# EAGLE design Xbee Remote (EAGLE 6.3)
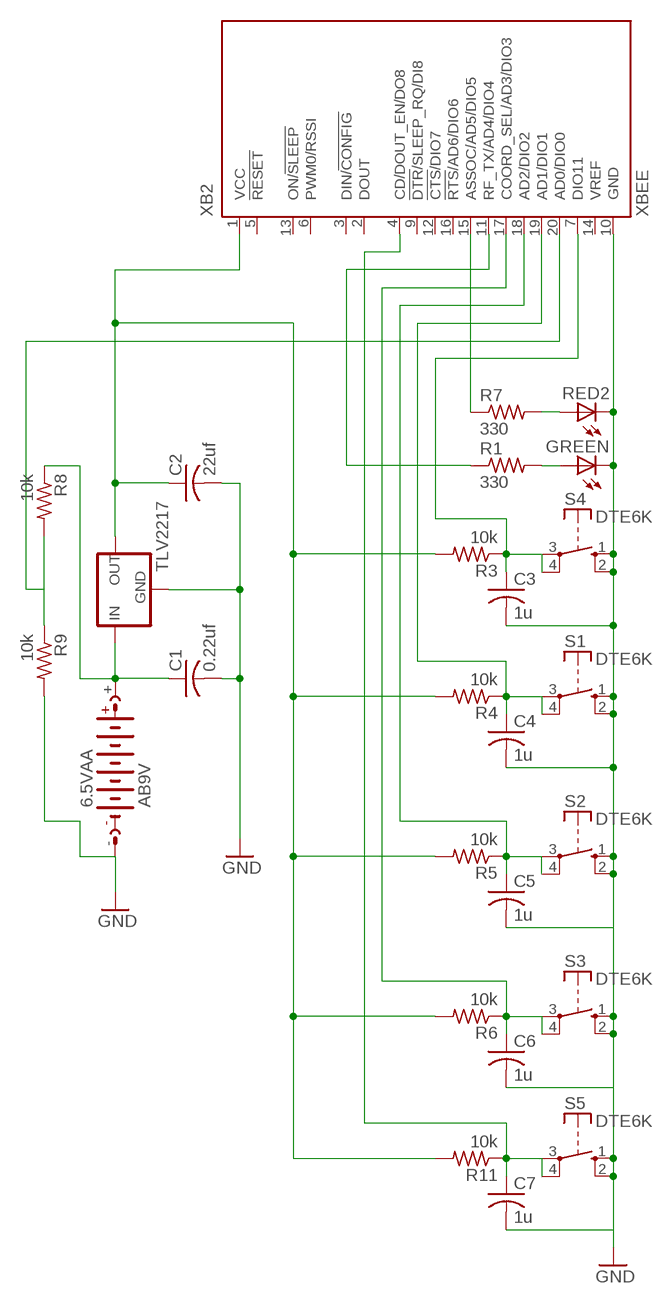
[diagram p0: schematic, sheet 1]

## Parts
6.5VAA  AB9V  [AB9V]
C1  0.22uf  C-US025-024X044  [C025-024X044]
C2  22uf  C-US025-024X044  [C025-024X044]
C3  1u  C-US025-024X044  [C025-024X044]
C4  1u  C-US025-024X044  [C025-024X044]
C5  1u  C-US025-024X044  [C025-024X044]
C6  1u  C-US025-024X044  [C025-024X044]
C7  1u  C-US025-024X044  [C025-024X044]
GREEN  LED5MM  [LED5MM]
R1  330  R-US_0204/5  [0204/5]
R3  10k  R-US_0204/5  [0204/5]
R4  10k  R-US_0204/5  [0204/5]
R5  10k  R-US_0204/5  [0204/5]
R6  10k  R-US_0204/5  [0204/5]
R7  330  R-US_0204/5  [0204/5]
R8  10k  R-US_0204/5  [0204/5]
R9  10k  R-US_0204/5  [0204/5]
R11  10k  R-US_0204/5  [0204/5]
RED2  LED5MM  [LED5MM]
S1  DTE6K  [DTE6K]
S2  DTE6K  [DTE6K]
S3  DTE6K  [DTE6K]
S4  DTE6K  [DTE6K]
S5  DTE6K  [DTE6K]
TLV2217  78XXS  [78XXS]
XB2  XBEE  [XBEE]

## Nets
GND: 6.5VAA.- C3.2 C4.2 C5.2 C6.2 C7.2 GREEN.K(C) R9.2 RED2.K(C) S1.1(S) S1.2(S) S2.1(S) S2.2(S) S3.1(S) S3.2(S) S4.1(S) S4.2(S) S5.1(S) S5.2(S) XB2.10(GND)
N$2: GREEN.A R1.2
N$3: 6.5VAA.+ C1.1 R8.1 TLV2217.IN
N$4: C2.1 R3.2 R4.2 R5.2 R6.2 R11.2 TLV2217.OUT XB2.1(VCC)
N$5: C7.1 R11.1 S5.3(P) S5.4(P) XB2.4(CD/DOUT_EN/DO8)
N$6: C1.2 C2.2 TLV2217.GND ; supply symbol labelled GND
N$7: R1.1 XB2.11(RF_TX/AD4/DIO4)
N$8: R7.2 RED2.A
N$10: R8.2 R9.1 XB2.20(AD0/DIO0)
N$11: C5.1 R5.1 S2.3(P) S2.4(P) XB2.18(AD2/DIO2)
N$12: C3.1 R3.1 S4.3(P) S4.4(P) XB2.7(DIO11)
N$13: C6.1 R6.1 S3.3(P) S3.4(P) XB2.17(COORD_SEL/AD3/DIO3)
N$14: R7.1 XB2.15(ASSOC/AD5/DIO5)
N$21: C4.1 R4.1 S1.3(P) S1.4(P) XB2.19(AD1/DIO1)
Unconnected: XB2.2(DOUT) XB2.3(DIN/!CONFIG) XB2.5(!RESET) XB2.6(PWM0/RSSI) XB2.9(!DTR!/SLEEP_RQ/DI8) XB2.12(!CTS!/DIO7) XB2.13(ON/!SLEEP) XB2.14(VREF) XB2.16(!RTS!/AD6/DIO6)

## Library data of the parts
6.5VAA = battery:AB9V: 9-V BATTERY CLIP
C1-C7 = rcl:C-US: CAPACITOR, American symbol
GREEN RED2 = led:LED: LED OSRAM: - CHIPLED LG R971, LG N971, LY N971, LG Q971, LY Q971, LO R971, LY R971 LH N974, LH R974 LS Q976, LO Q976, LY Q976 LO Q996 - Hyper CHIPLED LW Q18S LB Q993, LB Q99A, LB R99A - SideLED LS A670, LO A670, LY A670, LG A670, LP A670 LB A673, LV A673, LT A673, LW A673 LH A674 LY A675 LS A676, LA A676, LO A676, LY A676, LW A676 LS A679, LY A679, LG A679 - Hyper Micro SIDELED® LS Y876, LA Y876, LO Y876, LY Y876 LT Y87S - SmartLED LW L88C, LW L88S LB L89C, LB L89S, LG L890 LS L89K, LO L89K, LY L89K LS L896, LA L896, LO L896, LY L896 - TOPLED LS T670, LO T670, LY T670, LG T670, LP T670 LSG T670, LSP T670, LSY T670, LOP T670, LYG T670 LG T671, LOG T671, LSG T671 LB T673, LV T673, LT T673, LW T673 LH T674 LS T676, LA T676, LO T676, LY T676, LB T676, LH T676, LSB T676, LW T676 LB T67C, LV T67C, LT T67C, LS T67K, LO T67K, LY T67K, LW E67C LS E67B, LA E67B, LO E67B, LY E67B, LB E67C, LV E67C, LT E67C LW T67C LS T679, LY T679, LG T679 LS T770, LO T770, LY T770, LG T770, LP T770 LB T773, LV T773, LT T773, LW T773 LH T774 LS E675, LA E675, LY E675, LS T675 LS T776, LA T776, LO T776, LY T776, LB T776 LHGB T686 LT T68C, LB T68C - Hyper Mini TOPLED® LB M676 - Mini TOPLED Santana® LG M470 LS M47K, LO M47K, LY M47K Source: http://www.osram.convergy.de LUXEON: - LUMILED® LXK2-PW12-R00, LXK2-PW12-S00, LXK2-PW14-U00, LXK2-PW14-V00 LXK2-PM12-R00, LXK2-PM12-S00, LXK2-PM14-U00 LXK2-PE12-Q00, LXK2-PE12-R00, LXK2-PE12-S00, LXK2-PE14-T00, LXK2-PE14-U00 LXK2-PB12-K00, LXK2-PB12-L00, LXK2-PB12-M00, LXK2-PB14-N00, LXK2-PB14-P00, LXK2-PB14-Q00 LXK2-PR12-L00, LXK2-PR12-M00, LXK2-PR14-Q00, LXK2-PR14-R00 LXK2-PD12-Q00, LXK2-PD12-R00, LXK2-PD12-S00 LXK2-PH12-R00, LXK2-PH12-S00 LXK2-PL12-P00, LXK2-PL12-Q00, LXK2-PL12-R00 Source: www.luxeon.com KINGBRIGHT: KA-3528ASYC Source: www.kingbright.com
R1 R3-R9 R11 = resistor:R-US_: RESISTOR, American symbol
S1-S5 = switch-misc:DT: ITT SWITCH
TLV2217 = v-reg:78XXS: VOLTAGE REGULATOR
XB2 = maxstream:XBEE: XBee (TM) /XBee-PRO(TM) OEM RF Modules Source: MaxStream, Inc. xbee_productmanual.pdf; MPN: XBP24-Z7UIT-004; OC_FARNELL: 1751799; OC_NEWARK: 34R5507

## Board
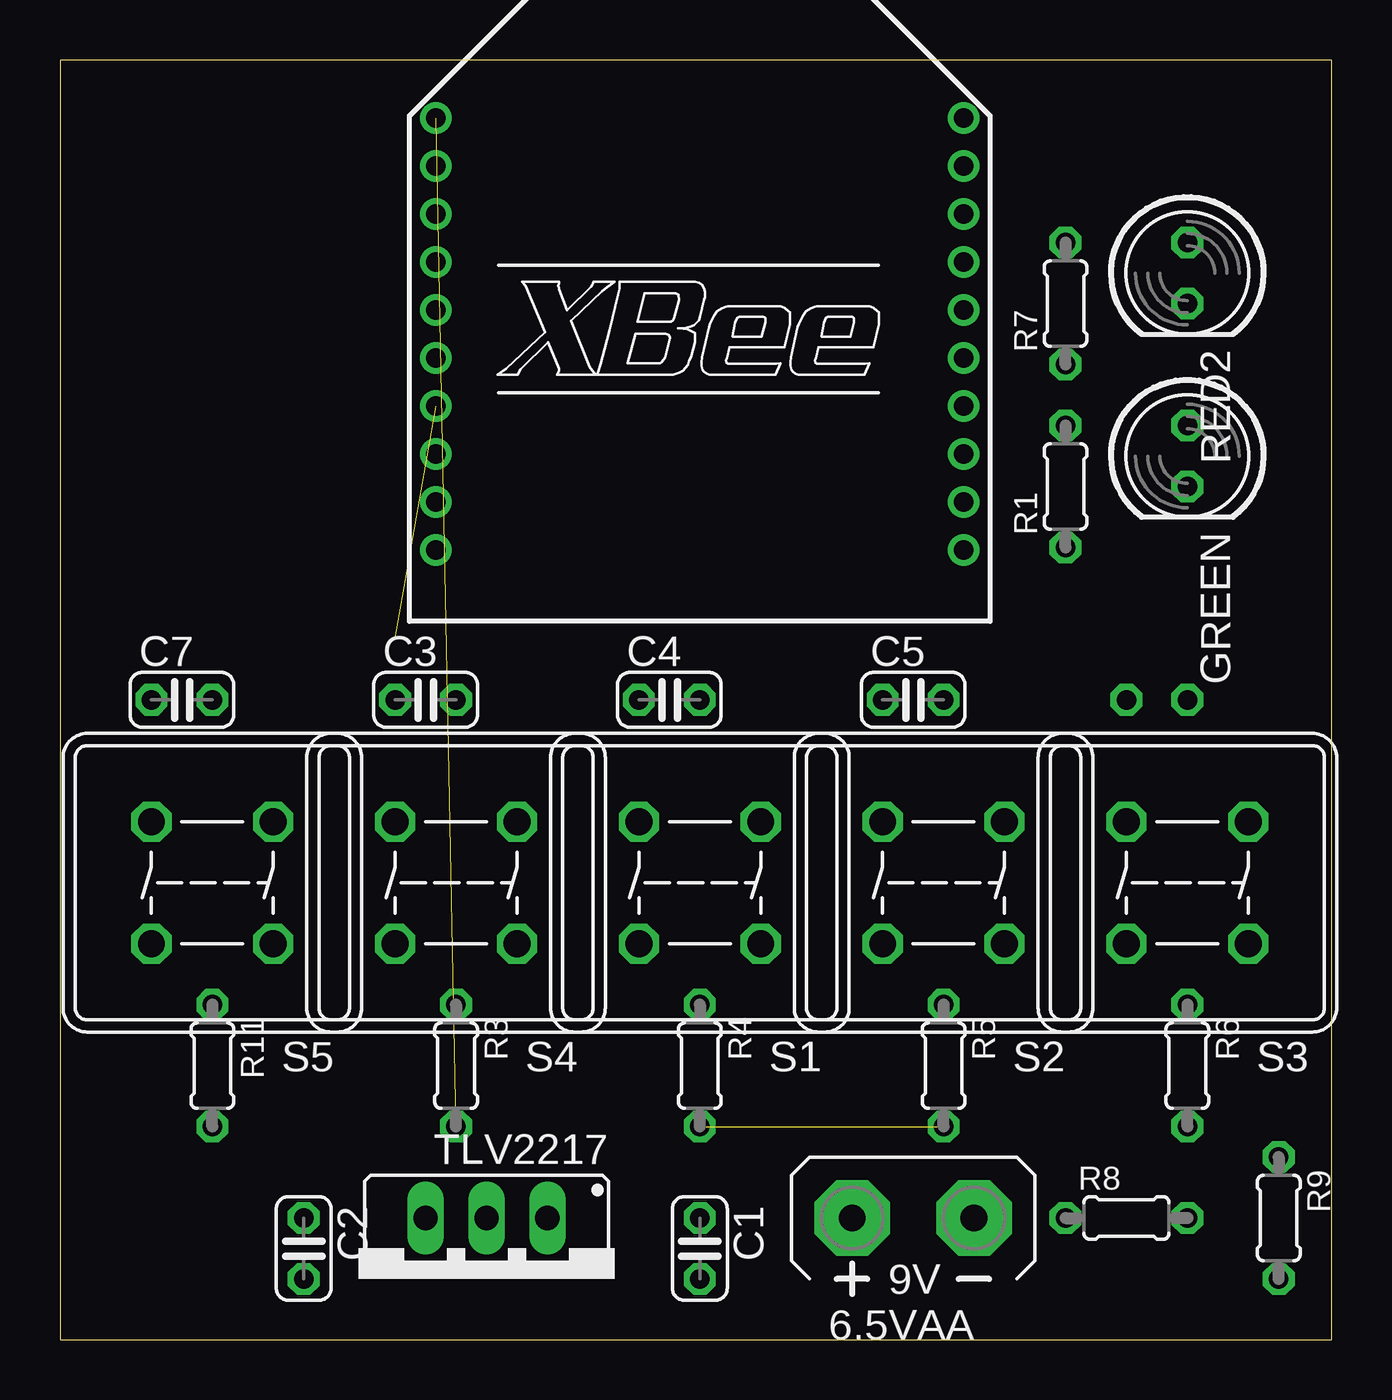
[diagram p1: board, top side]
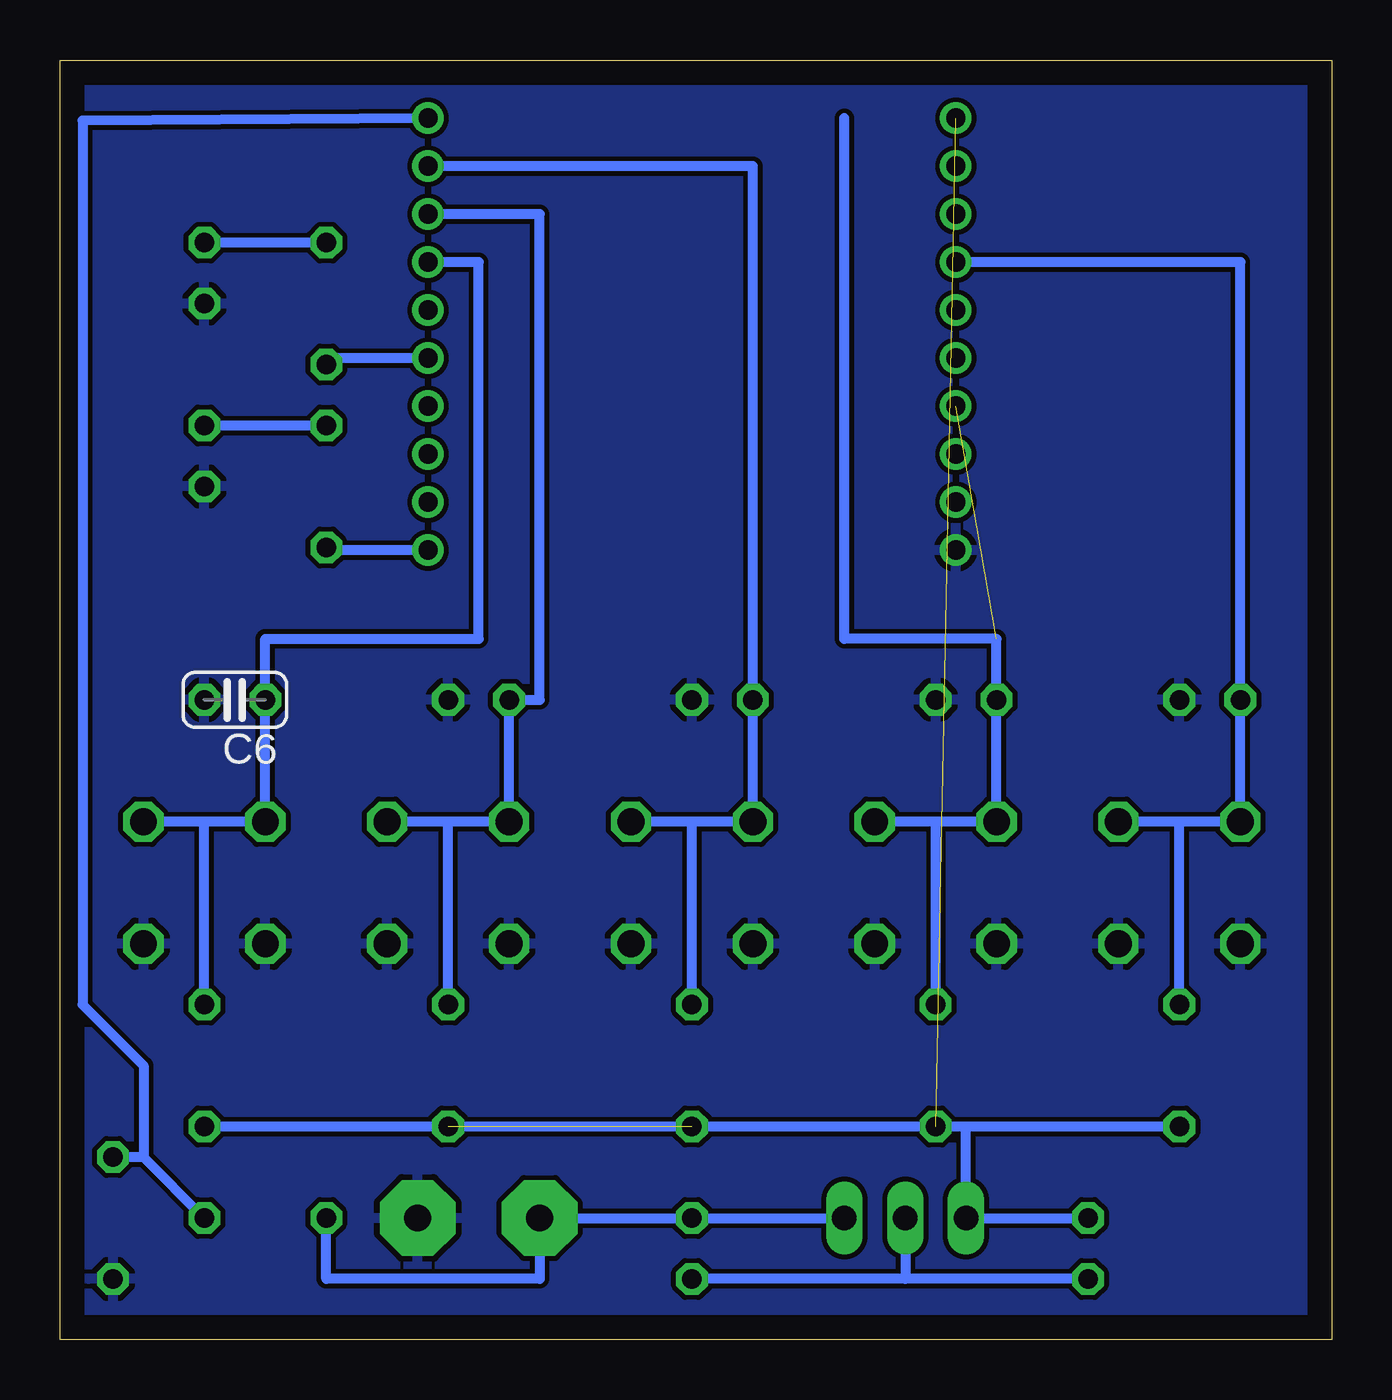
[diagram p2: board, bottom side, seen from below]

Size 53.01 x 53.33 mm. Coordinates in mm from the lower left corner, seen from the top.
Outline: 0,0 53.01,0 53.01,53.33 0,53.33 0,0
Copper layers (1*16): Top 0.035mm / dielectric 1.5mm / Bottom 0.035mm
Design rules "default": minimum track width 10mil, minimum drill 24mil, track to track 8mil, track to pad 8mil, pad to pad 8mil, via to via 8mil, smd to smd 8mil, copper to edge 40mil, drill to drill 8mil, minimum pad ring 10mil, minimum via ring 8mil, stop-mask expansion 4mil, vias tented up to drill 0mil, thermal gap 10mil

### Footprints (pad centres in the part's own frame; a part is rotated, then mirrored left to right if it is on the bottom)
AB9V = drill 1.118 pad 3.15 octagon: + 0,2.54; - 0,-2.54
C025-024X044 = drill 0.813 octagon: 1 -1.27,0; 2 1.27,0
LED5MM = drill 0.813 octagon: A -1.27,0; K 1.27,0
0204/5 = drill 0.813 octagon: 1 -2.54,0; 2 2.54,0
DTE6K = drill 1.118 octagon: 1 -2.54,2.54; 2 2.54,2.54; 3 2.54,-2.54; 4 -2.54,-2.54
78XXS = drill 1.016 long: GND 0,-2.54; IN -2.54,-2.54; OUT 2.54,-2.54
XBEE = drill 0.8 pad 1.27: 1 -11,9; 2 -11,7; 3 -11,5; 4 -11,3; 5 -11,1; 6 -11,-1; 7 -11,-3; 8 -11,-5; 9 -11,-7; 10 -11,-9; 11 11,-9; 12 11,-7; 13 11,-5; 14 11,-3; 15 11,-1; 16 11,1; 17 11,3; 18 11,5; 19 11,7; 20 11,9

### Placement (x,y rotation side)
6.5VAA  35.56,5.08 90 top
C1  26.67,3.81 270 top
C2  10.16,3.81 270 top
C3  15.24,26.67 0 top
C4  25.4,26.67 0 top
C5  35.56,26.67 0 top
C6  45.72,26.67 180 bottom
C7  5.08,26.67 0 top
GREEN  46.99,36.83 270 top
R1  41.91,35.56 90 top
R3  16.51,11.43 270 top
R4  26.67,11.43 270 top
R5  36.83,11.43 270 top
R6  46.99,11.43 270 top
R7  41.91,43.18 90 top
R8  44.45,5.08 0 top
R9  50.8,5.08 270 top
R11  6.35,11.43 270 top
RED2  46.99,44.45 270 top
S1  26.67,19.05 180 top
S2  36.83,19.05 180 top
S3  46.99,19.05 180 top
S4  16.51,19.05 180 top
S5  6.35,19.05 180 top
TLV2217  17.78,2.54 180 top
XB2  26.67,41.91 0 top

### Tracks (layer width: path | path; a pad name or v marks a point on that pad's centre or on a via)
GND
  pour Bottom: 0,53.34 53.34,53.34 53.34,52.07 53.34,0 0,0
N$2
  Bottom 0.406: R1.2 GREEN.A
N$3
  Bottom 0.406: TLV2217.IN C1.1 6.5VAA.+ 33.02,2.54 41.91,2.54 R8.1
N$4  (2 unrouted)
  Bottom 0.406: R6.2 R5.2 R3.2 15.24,8.89 | C2.1 TLV2217.OUT 15.24,8.89 | R11.2 15.24,8.89
N$5
  Bottom 0.406: 6.35,21.59 S5.3 C7.1 3.81,44.91 XB2.4 | 6.35,21.59 S5.4 | R11.1 6.35,21.59
N$6
  Bottom 0.406: C2.2 17.78,2.54 | 17.78,2.54 C1.2 | TLV2217.GND 17.78,2.54
N$7
  Bottom 0.406: XB2.11 41.91,32.91 R1.1
N$8
  Bottom 0.406: R7.2 RED2.A
N$10
  Bottom 0.406: R8.2 49.53,7.62 | 49.53,7.62 R9.1 | XB2.20 52.07,50.8 52.07,13.97 49.53,11.43 49.53,7.62
N$11
  Bottom 0.406: 36.83,21.59 S2.3 C5.1 33.02,26.67 33.02,46.91 XB2.18 | 36.83,21.59 S2.4 | R5.1 36.83,21.59
N$12  (1 unrouted)
  Bottom 0.406: 16.51,21.59 S4.3 C3.1 13.97,29.21 20.32,29.21 20.32,50.91 | 16.51,21.59 S4.4 | R3.1 16.51,21.59
N$13
  Bottom 0.406: 46.99,21.59 S3.3 C6.1 44.45,29.21 35.56,29.21 35.56,44.91 XB2.17 | 46.99,21.59 S3.4 | R6.1 46.99,21.59
N$14
  Bottom 0.406: XB2.15 41.91,40.91 R7.1
N$21
  Bottom 0.406: 26.67,21.59 S1.3 C4.1 24.13,48.91 XB2.19 | 26.67,21.59 S1.4 | R4.1 26.67,21.59